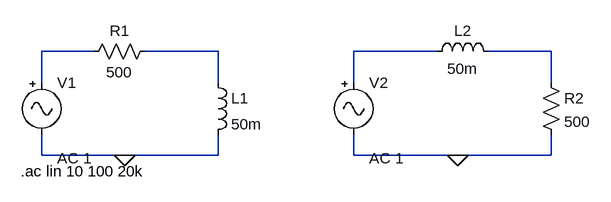
[diagram p0: schematic RL-prede.asc]
RL-prede.asc, the LTspice schematic file:
Version 4.1
SHEET 1 880 680
WIRE 48 96 -32 96
WIRE 240 96 128 96
WIRE 576 96 448 96
WIRE 752 96 656 96
WIRE -32 144 -32 96
WIRE 240 144 240 96
WIRE 448 144 448 96
WIRE 752 144 752 96
WIRE -32 256 -32 224
WIRE 96 256 -32 256
WIRE 240 256 240 224
WIRE 240 256 96 256
WIRE 448 256 448 224
WIRE 608 256 448 256
WIRE 752 256 752 224
WIRE 752 256 608 256
FLAG 96 256 0
FLAG 608 256 0
SYMBOL res 144 80 R90
WINDOW 0 0 56 VBottom 2
WINDOW 3 32 56 VTop 2
SYMATTR InstName R1
SYMATTR Value 500
SYMBOL ind 224 128 R0
SYMATTR InstName L1
SYMATTR Value 50m
SYMBOL Misc\\signal -32 128 R0
WINDOW 123 24 132 Left 2
WINDOW 39 0 0 Left 0
SYMATTR Value2 AC 1
SYMATTR InstName V1
SYMATTR Value ""
SYMBOL Misc\\signal 448 128 R0
WINDOW 123 24 132 Left 2
WINDOW 39 0 0 Left 0
SYMATTR Value2 AC 1
SYMATTR InstName V2
SYMATTR Value ""
SYMBOL ind 560 112 R270
WINDOW 0 32 56 VTop 2
WINDOW 3 5 56 VBottom 2
SYMATTR InstName L2
SYMATTR Value 50m
SYMBOL res 736 128 R0
SYMATTR InstName R2
SYMATTR Value 500
TEXT -64 280 Left 2 !.ac lin 10 100 20k

The netlist it stands for:
* RL-prede.asc
R1 N002 N001 500
L1 N002 0 50m
V1 N001 0 AC 1
V2 N003 0 AC 1
L2 N003 N004 50m
R2 N004 0 500
.ac lin 10 100 20k
.backanno
.end